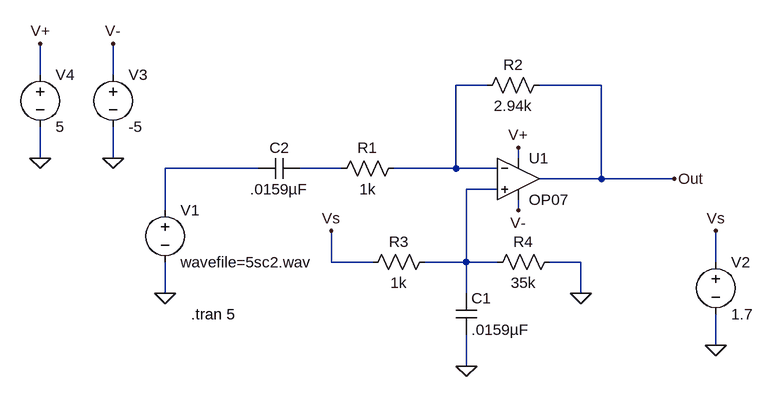
[diagram p0: schematic Biasing AC voltage for ADC input.asc]
Biasing AC voltage for ADC input.asc, the LTspice schematic file:
Version 4
SHEET 1 880 680
WIRE -240 -80 -240 -128
WIRE -128 -80 -128 -128
WIRE 448 -64 400 -64
WIRE 624 -64 528 -64
WIRE -240 48 -240 0
WIRE -128 48 -128 0
WIRE 496 48 496 32
WIRE 96 64 -48 64
WIRE 224 64 160 64
WIRE 400 64 400 -64
WIRE 400 64 304 64
WIRE 464 64 400 64
WIRE 624 80 624 -64
WIRE 624 80 528 80
WIRE 736 80 624 80
WIRE 464 96 416 96
WIRE -48 128 -48 64
WIRE 496 128 496 112
WIRE 208 208 208 160
WIRE 272 208 208 208
WIRE 416 208 416 96
WIRE 416 208 352 208
WIRE 464 208 416 208
WIRE 592 208 544 208
WIRE 800 208 800 160
WIRE -48 256 -48 208
WIRE 416 256 416 208
WIRE 592 256 592 208
WIRE 800 336 800 288
WIRE 416 368 416 320
FLAG 592 256 0
FLAG 736 80 Out
FLAG 416 368 0
FLAG 208 160 Vs
FLAG -48 256 0
FLAG 800 160 Vs
FLAG 800 336 0
FLAG -128 48 0
FLAG -240 48 0
FLAG -240 -128 V+
FLAG -128 -128 V-
FLAG 496 128 V-
FLAG 496 32 V+
SYMBOL OpAmps\\OP07 496 16 R0
SYMATTR InstName U1
SYMBOL res 544 -80 R90
WINDOW 0 0 56 VBottom 2
WINDOW 3 32 56 VTop 2
SYMATTR InstName R2
SYMATTR Value 2.94k
SYMBOL res 560 192 R90
WINDOW 0 0 56 VBottom 2
WINDOW 3 32 56 VTop 2
SYMATTR InstName R4
SYMATTR Value 35k
SYMBOL cap 400 256 R0
SYMATTR InstName C1
SYMATTR Value .0159µF
SYMBOL res 320 48 R90
WINDOW 0 0 56 VBottom 2
WINDOW 3 32 56 VTop 2
SYMATTR InstName R1
SYMATTR Value 1k
SYMBOL res 368 192 R90
WINDOW 0 0 56 VBottom 2
WINDOW 3 32 56 VTop 2
SYMATTR InstName R3
SYMATTR Value 1k
SYMBOL cap 160 48 R90
WINDOW 0 0 32 VBottom 2
WINDOW 3 32 32 VTop 2
SYMATTR InstName C2
SYMATTR Value .0159µF
SYMBOL voltage -48 112 R0
SYMATTR InstName V1
SYMATTR Value wavefile=5sc2.wav
SYMBOL voltage 800 192 R0
SYMATTR InstName V2
SYMATTR Value 1.7
SYMBOL voltage -128 -96 R0
SYMATTR InstName V3
SYMATTR Value -5
SYMBOL voltage -240 -96 R0
WINDOW 123 0 0 Left 0
WINDOW 39 0 0 Left 0
SYMATTR InstName V4
SYMATTR Value 5
TEXT -8 288 Left 2 !.tran 5

The netlist it stands for:
* Biasing AC voltage for ADC input.asc
XU1 N004 N001 V+ V- Out LT1001  ; OP07, pins In+ In- V+ V- OUT
R2 Out N001 2.94k
R4 0 N004 35k
C1 N004 0 .0159µF
R1 N001 N003 1k
R3 N004 Vs 1k
C2 N003 N002 .0159µF
V1 N002 0 wavefile=5sc2.wav
V2 Vs 0 1.7
V3 V- 0 -5
V4 V+ 0 5
.tran 5
.lib LTC.lib
.backanno
.end